# EAGLE design ProtoShield_V4.0 (EAGLE 7.2.0)
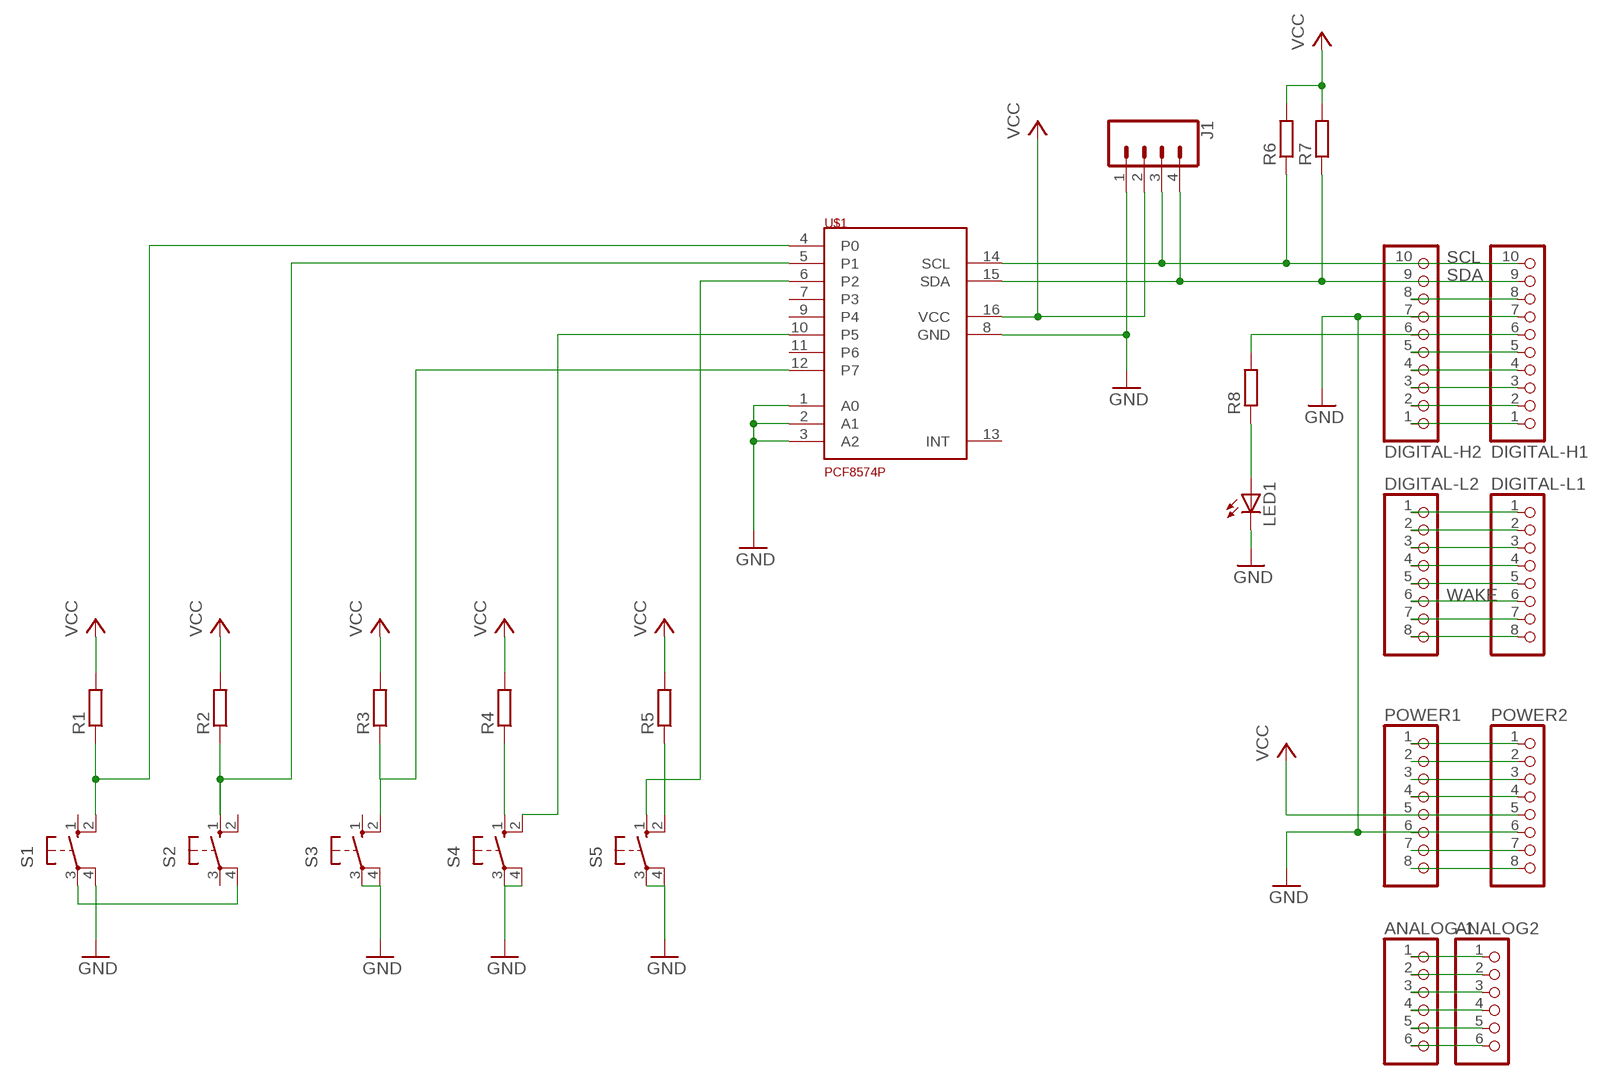
[diagram p0: schematic, sheet 1]

## Parts
ANALOG2  PINHD-1X6  [1X06]
ANALOG-1  PINHD-1X6  [1X06]
DIGITAL-H1  PINHD-1X10TH  [1X10-TH]
DIGITAL-H2  PINHD-1X10TH  [1X10-TH]
DIGITAL-L1  PINHD-1X8  [1X08]
DIGITAL-L2  PINHD-1X8  [1X08]
J1  CONN_04PTH  [1X04]
LED1  LED3MM  [LED3MM]
POWER1  PINHD-1X8TH  [1X08-TH]
POWER2  PINHD-1X8TH  [1X08-TH]
R1  R-EU_0207/10  [0207/10]
R2  R-EU_0207/10  [0207/10]
R3  R-EU_0207/10  [0207/10]
R4  R-EU_0207/10  [0207/10]
R5  R-EU_0207/10  [0207/10]
R6  R-EU_0207/10  [0207/10]
R7  R-EU_0207/10  [0207/10]
R8  R-EU_0207/10  [0207/10]
S1  10-XX  [B3F-10XX]
S2  10-XX  [B3F-10XX]
S3  10-XX  [B3F-10XX]
S4  10-XX  [B3F-10XX]
S5  10-XX  [B3F-10XX]
U$1  PCF8574P  [DIL16]

## Nets
GND: DIGITAL-H1.7 DIGITAL-H2.7 J1.1 LED1.K(C) POWER1.6 POWER2.6 S1.4(P1) S3.3(P) S3.4(P1) S4.3(P) S4.4(P1) S5.3(P) S5.4(P1) U$1.1(A0) U$1.2(A1) U$1.3(A2) U$1.8(GND)
IOREF: POWER1.2 POWER2.2
N$1: DIGITAL-H1.6 DIGITAL-H2.6 R8.2
N$2: DIGITAL-H1.1 DIGITAL-H2.1
N$3: DIGITAL-H1.4 DIGITAL-H2.4
N$4: DIGITAL-H1.5 DIGITAL-H2.5
N$5: R2.1 S2.1(S) U$1.5(P1)
N$6: DIGITAL-H1.2 DIGITAL-H2.2
N$7: DIGITAL-H1.3 DIGITAL-H2.3
N$8: DIGITAL-L1.1 DIGITAL-L2.1
N$9: DIGITAL-L1.2 DIGITAL-L2.2
N$10: DIGITAL-L1.3 DIGITAL-L2.3
N$11: DIGITAL-L1.4 DIGITAL-L2.4
N$12: DIGITAL-L1.5 DIGITAL-L2.5
N$13: POWER1.7 POWER2.7
N$14: DIGITAL-L1.7 DIGITAL-L2.7
N$15: DIGITAL-L1.8 DIGITAL-L2.8
N$16: S1.3(P) S2.4(P1)
N$17: R1.1 S1.2(S1) U$1.4(P0)
N$18: ANALOG2.1 ANALOG-1.1
N$19: ANALOG2.2 ANALOG-1.2
N$20: ANALOG2.3 ANALOG-1.3
N$21: ANALOG2.4 ANALOG-1.4
N$22: ANALOG2.5 ANALOG-1.5
N$23: ANALOG2.6 ANALOG-1.6
N$24: LED1.A R8.1
N$26: R3.1 S3.2(S1) U$1.12(P7)
N$27: POWER1.3 POWER2.3
N$28: POWER1.8 POWER2.8
N$29: R4.1 S4.1(S)
N$31: R5.1 S5.2(S1)
N$32: POWER1.1 POWER2.1
N$33: S4.2(S1) U$1.10(P5)
N$36: POWER1.4 POWER2.4
N$37: S5.1(S) U$1.6(P2)
N$222: DIGITAL-H1.8 DIGITAL-H2.8
SCL: DIGITAL-H1.10 DIGITAL-H2.10 J1.3 R6.1 U$1.14(SCL)
SDA: DIGITAL-H1.9 DIGITAL-H2.9 J1.4 R7.1 U$1.15(SDA)
VCC: J1.2 POWER1.5 POWER2.5 R1.2 R2.2 R3.2 R4.2 R5.2 R6.2 R7.2 U$1.16(VCC)
WAKE: DIGITAL-L1.6 DIGITAL-L2.6
Unconnected: S1.1(S) S2.2(S1) S2.3(P) S3.1(S) U$1.7(P3) U$1.9(P4) U$1.11(P6) U$1.13(INT)

## Library data of the parts
ANALOG2 ANALOG-1 = pinhead:PINHD-1X6: PIN HEADER; OC_FARNELL: unknown
DIGITAL-H1 DIGITAL-H2 = SmartPrj:PINHD-1X10: PIN HEADER; OC_FARNELL: unknown
DIGITAL-L1 DIGITAL-L2 = pinhead:PINHD-1X8: PIN HEADER; MF: EPCOS; MPN: B67345B0001X087; OC_FARNELL: 2355112
J1 = SparkFun-Connectors:CONN_04: Multi connection point. Often used as Generic Header-pin footprint for 0.1 inch spaced/style header connections On any of the 0.1 inch spaced packages, you can populate with these: Break Away Headers - Straight <https://www.sparkfun.com/products/116> (PRT-00116) Break Away Male Headers - Right Angle <https://www.sparkfun.com/products/553> (PRT-00553) Female Headers <https://www.sparkfun.com/products/115> (PRT-00115) Break Away Headers - Machine Pin <https://www.sparkfun.com/products/117> (PRT-00117) Break Away Female Headers - Swiss Machine Pin <https://www.sparkfun.com/products/743> (PRT-00743) For SCREWTERMINALS and SPRING TERMINALS visit here: Screw Terimnals on SparkFun.com <https://www.sparkfun.com/search/results?term=Screw+Terminals> (5mm/3.5mm/2.54mm spacing) This device is also useful as a general connection point to wire up your design to another part of your project. Our various solder wires solder well into these plated through hole pads. Hook-Up Wire - Assortment (Stranded, 22 AWG) <https://www.sparkfun.com/products/11375> (PRT-11375) Hook-Up Wire - Assortment (Solid Core, 22 AWG) <https://www.sparkfun.com/products/11367> (PRT-11367) View the entire wire category on our website here <https://www.sparkfun.com/categories/141> Special notes: Molex polarized connector foot print use with SKU : PRT-08231 with associated crimp pins and housings. 1MM SMD Version SKU: PRT-10208; PROD_ID: CONN-09696
LED1 = led:LED: LED OSRAM: - CHIPLED LG R971, LG N971, LY N971, LG Q971, LY Q971, LO R971, LY R971 LH N974, LH R974 LS Q976, LO Q976, LY Q976 LO Q996 - Hyper CHIPLED LW Q18S LB Q993, LB Q99A, LB R99A - SideLED LS A670, LO A670, LY A670, LG A670, LP A670 LB A673, LV A673, LT A673, LW A673 LH A674 LY A675 LS A676, LA A676, LO A676, LY A676, LW A676 LS A679, LY A679, LG A679 - Hyper Micro SIDELED® LS Y876, LA Y876, LO Y876, LY Y876 LT Y87S - SmartLED LW L88C, LW L88S LB L89C, LB L89S, LG L890 LS L89K, LO L89K, LY L89K LS L896, LA L896, LO L896, LY L896 - TOPLED LS T670, LO T670, LY T670, LG T670, LP T670 LSG T670, LSP T670, LSY T670, LOP T670, LYG T670 LG T671, LOG T671, LSG T671 LB T673, LV T673, LT T673, LW T673 LH T674 LS T676, LA T676, LO T676, LY T676, LB T676, LH T676, LSB T676, LW T676 LB T67C, LV T67C, LT T67C, LS T67K, LO T67K, LY T67K, LW E67C LS E67B, LA E67B, LO E67B, LY E67B, LB E67C, LV E67C, LT E67C LW T67C LS T679, LY T679, LG T679 LS T770, LO T770, LY T770, LG T770, LP T770 LB T773, LV T773, LT T773, LW T773 LH T774 LS E675, LA E675, LY E675, LS T675 LS T776, LA T776, LO T776, LY T776, LB T776 LHGB T686 LT T68C, LB T68C - Hyper Mini TOPLED® LB M676 - Mini TOPLED Santana® LG M470 LS M47K, LO M47K, LY M47K Source: http://www.osram.convergy.de LUXEON: - LUMILED® LXK2-PW12-R00, LXK2-PW12-S00, LXK2-PW14-U00, LXK2-PW14-V00 LXK2-PM12-R00, LXK2-PM12-S00, LXK2-PM14-U00 LXK2-PE12-Q00, LXK2-PE12-R00, LXK2-PE12-S00, LXK2-PE14-T00, LXK2-PE14-U00 LXK2-PB12-K00, LXK2-PB12-L00, LXK2-PB12-M00, LXK2-PB14-N00, LXK2-PB14-P00, LXK2-PB14-Q00 LXK2-PR12-L00, LXK2-PR12-M00, LXK2-PR14-Q00, LXK2-PR14-R00 LXK2-PD12-Q00, LXK2-PD12-R00, LXK2-PD12-S00 LXK2-PH12-R00, LXK2-PH12-S00 LXK2-PL12-P00, LXK2-PL12-Q00, LXK2-PL12-R00 Source: www.luxeon.com KINGBRIGHT: KA-3528ASYC Source: www.kingbright.com
POWER1 POWER2 = SmartPrj:PINHD-1X8: PIN HEADER; OC_FARNELL: unknown
R1-R8 = resistor:R-EU_: RESISTOR, European symbol
S1-S5 = switch-omron:10-XX: OMRON SWITCH; MPN: B3F-1000; OC_FARNELL: 176432; OC_NEWARK: 36M3542
U$1 = pcf8574p:PCF8574P

## Net classes
0 default: clearance 0.405 mm

## Board
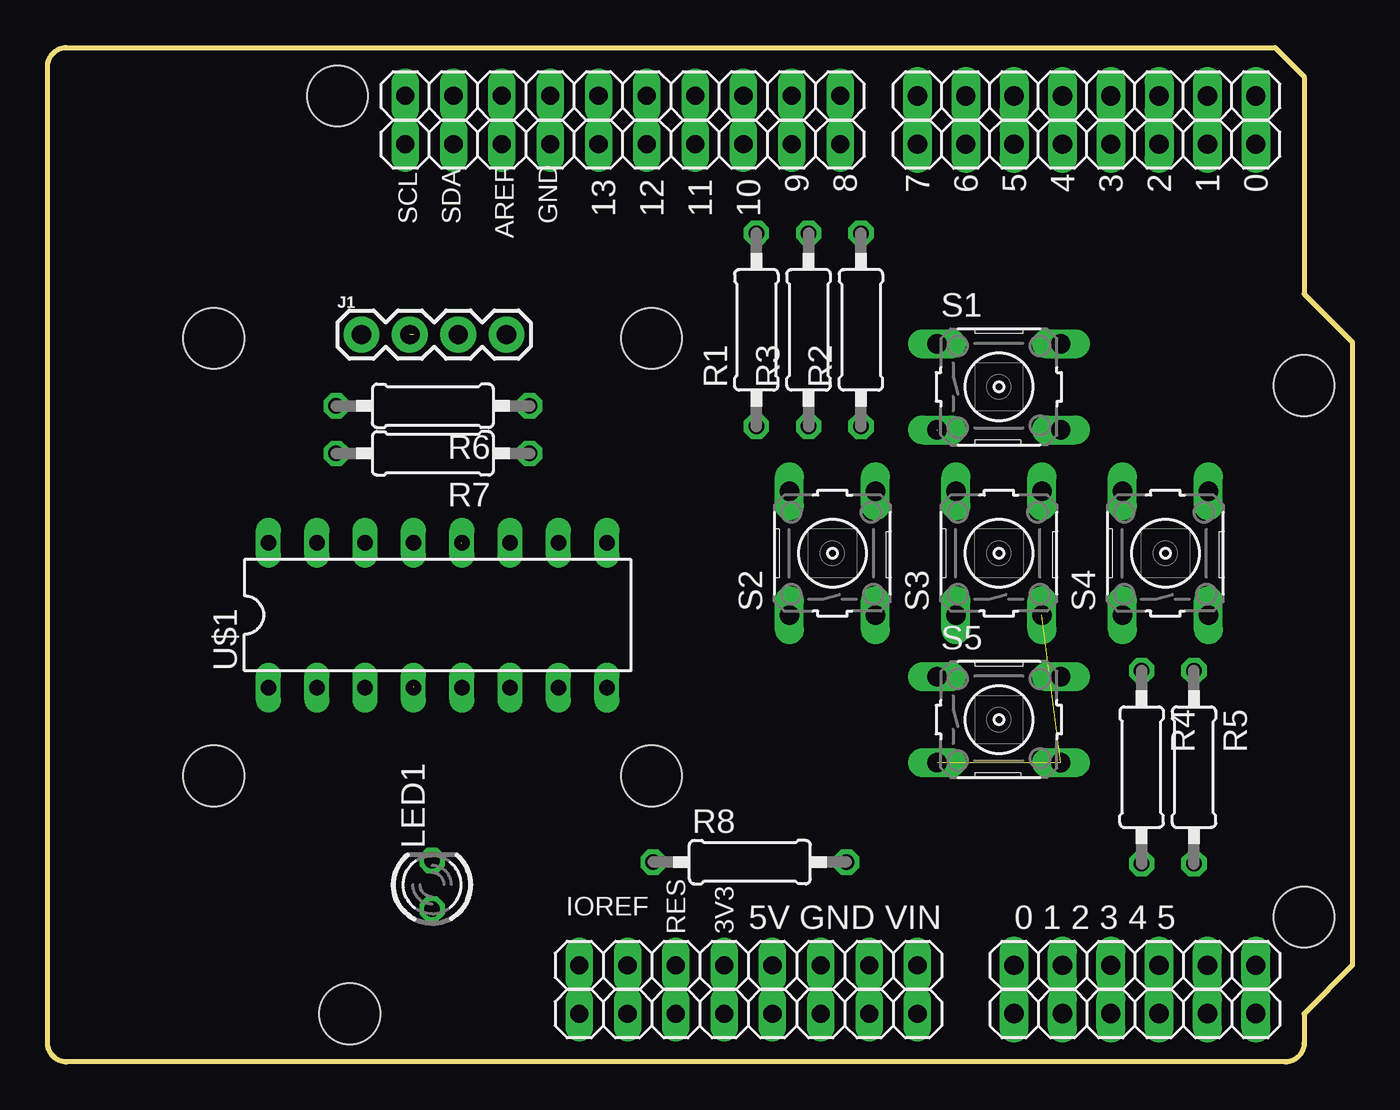
[diagram p1: board, top side]
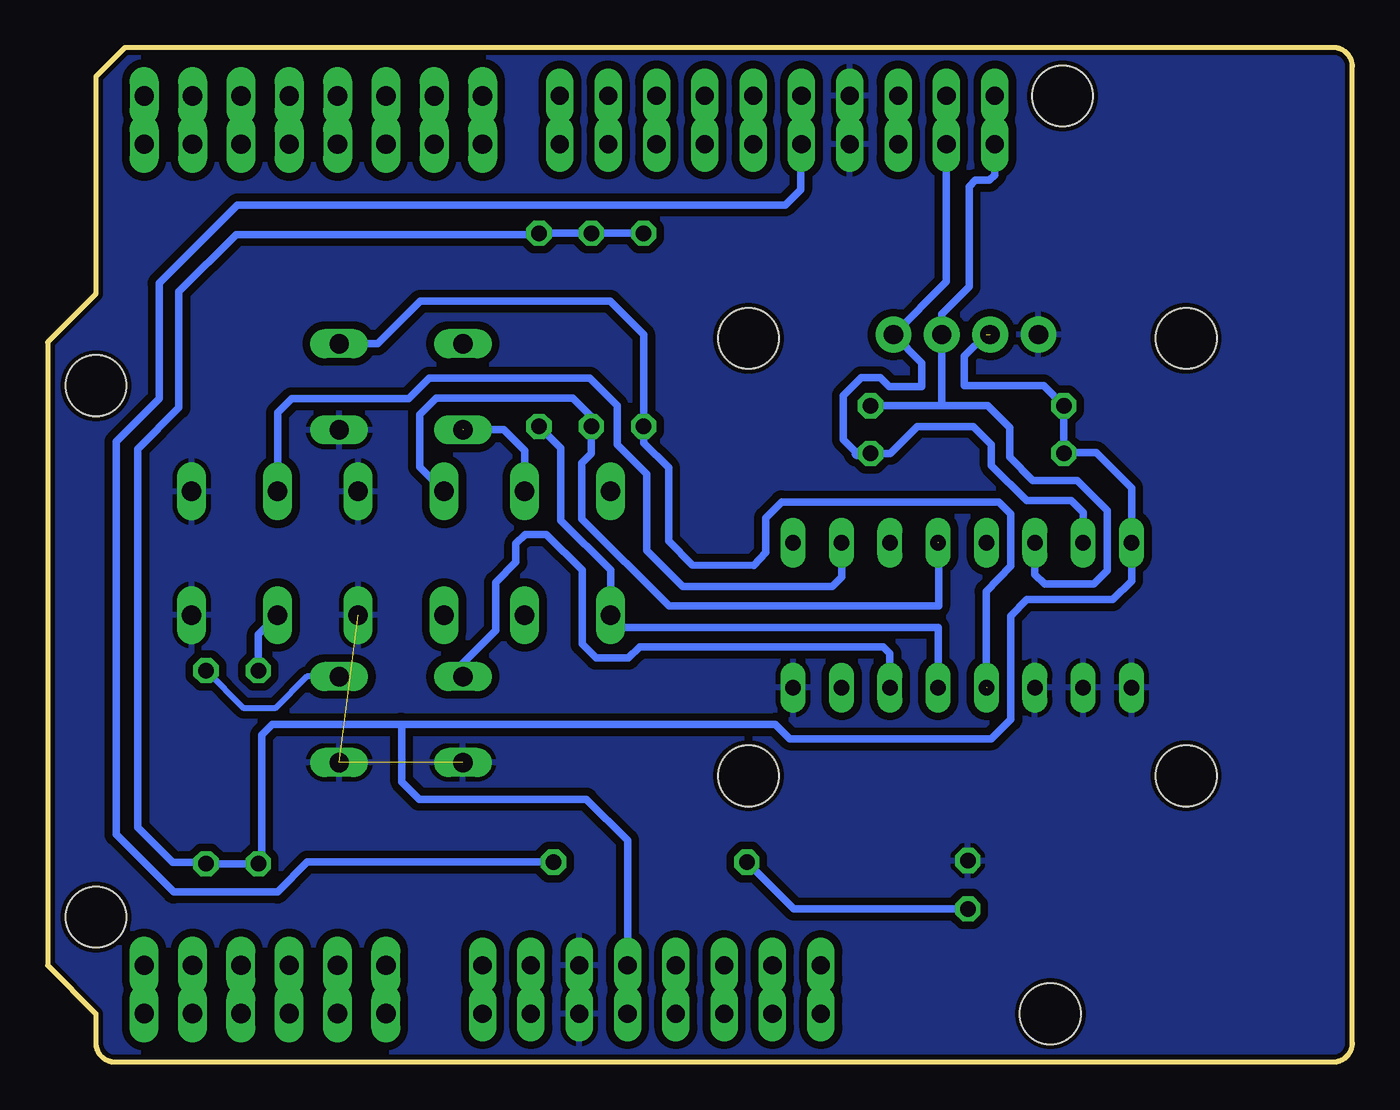
[diagram p2: board, bottom side, seen from below]

Size 68.58 x 53.34 mm. Coordinates in mm from the lower left corner, seen from the top.
Outline: 64.52,53.34 66.04,51.82 66.04,40.39 68.58,37.85 68.58,5.08 66.04,2.54 66.04,1 arc-90 65.04,0 1,0 arc-90 0,1 0,52.34 arc-90 1,53.34 64.52,53.34
Copper layers (1*16): Top 0.035mm / dielectric 1.5mm / Bottom 0.035mm
Design rules "SeeedStudio_2layers *": minimum track width 6mil, minimum drill 12mil, track to track 8mil, track to pad 8mil, pad to pad 8mil, via to via 8mil, smd to smd 0mil, copper to edge 10mil, drill to drill 10mil, minimum pad ring 10mil, minimum via ring 6mil, stop-mask expansion 2mil, vias tented up to drill 100mil, thermal gap 10mil
Holes 3.2 mm at 15.24,50.8 66.04,7.62 66.04,35.56 15.88,2.54 8.74,38.05 31.74,38.05 8.74,15.05 31.74,15.05

### Footprints (pad centres in the part's own frame; a part is rotated, then mirrored left to right if it is on the bottom)
1X06 = drill 1.016 long: 1 -6.35,0; 2 -3.81,0; 3 -1.27,0; 4 1.27,0; 5 3.81,0; 6 6.35,0
1X10-TH = drill 0.95 pad 1.422 long: 1 -11.43,0; 2 -8.89,0; 3 -6.35,0; 4 -3.81,0; 5 -1.27,0; 6 1.27,0; 7 3.81,0; 8 6.35,0; 9 8.89,0; 10 11.43,0
1X08 = drill 1.016 long: 1 -8.89,0; 2 -6.35,0; 3 -3.81,0; 4 -1.27,0; 5 1.27,0; 6 3.81,0; 7 6.35,0; 8 8.89,0
1X04 = drill 1.016 pad 1.88: 1 0,0; 2 2.54,0; 3 5.08,0; 4 7.62,0
LED3MM = drill 0.813 octagon: A -1.27,0; K 1.27,0
1X08-TH = drill 0.95 pad 1.422 long: 1 -8.89,0; 2 -6.35,0; 3 -3.81,0; 4 -1.27,0; 5 1.27,0; 6 3.81,0; 7 6.35,0; 8 8.89,0
0207/10 = drill 0.813 octagon: 1 -5.08,0; 2 5.08,0
B3F-10XX = drill 1.016 long: 1 -3.251,2.261; 2 3.251,2.261; 3 -3.251,-2.261; 4 3.251,-2.261
DIL16 = drill 0.813 long: 1 -8.89,-3.81; 2 -6.35,-3.81; 3 -3.81,-3.81; 4 -1.27,-3.81; 5 1.27,-3.81; 6 3.81,-3.81; 7 6.35,-3.81; 8 8.89,-3.81; 9 8.89,3.81; 10 6.35,3.81; 11 3.81,3.81; 12 1.27,3.81; 13 -1.27,3.81; 14 -3.81,3.81; 15 -6.35,3.81; 16 -8.89,3.81

### Placement (x,y rotation side)
ANALOG2  57.15,5.08 0 top
ANALOG-1  57.15,2.54 0 top
DIGITAL-H1  30.23,48.26 180 top
DIGITAL-H2  30.23,50.8 180 top
DIGITAL-L1  54.61,48.26 180 top
DIGITAL-L2  54.61,50.8 180 top
J1  16.5,38.25 0 top
LED1  20.21,9.32 90 top
POWER1  36.83,5.08 0 top
POWER2  36.83,2.54 0 top
R1  37.25,38.5 90 top
R2  42.75,38.5 90 top
R3  40,38.5 90 top
R4  57.5,15.5 270 top
R5  60.25,15.5 270 top
R6  20.25,34.5 180 top
R7  20.25,32 180 top
R8  36.91,10.51 0 top
S1  50,35.5 0 top
S2  41.25,26.75 90 top
S3  50,26.75 90 top
S4  58.75,26.75 90 top
S5  50,18 0 top
U$1  20.5,23.5 0 top

### Tracks (layer width: path | path; a pad name or v marks a point on that pad's centre or on a via)
GND  (2 unrouted)
  pour Bottom: -1.27,54.61 69.85,54.61 69.85,-2.54 -1.27,-2.54
IOREF
  Bottom 0.813: POWER2.2 POWER1.2
N$1
  Bottom 0.406: 29.01,48.21 29.01,45.87 29.82,45.06 58.6,45.06 62.71,40.95 62.71,34.87 64.97,32.61 64.97,11.96 61.95,8.94 56.49,8.94 54.92,10.51 R8.2
  Bottom 0.61: 29.01,48.21 DIGITAL-H1.6
  Bottom 0.813: DIGITAL-H1.6 DIGITAL-H2.6
N$2
  Bottom 0.813: DIGITAL-H1.1 DIGITAL-H2.1
N$3
  Bottom 0.813: DIGITAL-H1.4 DIGITAL-H2.4
N$4
  Bottom 0.813: DIGITAL-H1.5 DIGITAL-H2.5
N$5
  Bottom 0.406: R2.1 41.61,32.28 41.61,28.48 38.99,25.86 S2.1 38.35,22.86 21.77,22.86 U$1.5
N$6
  Bottom 0.813: DIGITAL-H1.2 DIGITAL-H2.2
N$7
  Bottom 0.813: DIGITAL-H1.3 DIGITAL-H2.3
N$8
  Bottom 0.813: DIGITAL-L1.1 DIGITAL-L2.1
N$9
  Bottom 0.813: DIGITAL-L1.2 DIGITAL-L2.2
N$10
  Bottom 0.813: DIGITAL-L1.3 DIGITAL-L2.3
N$11
  Bottom 0.813: DIGITAL-L1.4 DIGITAL-L2.4
N$12
  Bottom 0.813: DIGITAL-L1.5 DIGITAL-L2.5
N$13
  Bottom 0.61: POWER2.7 POWER1.7
N$14
  Bottom 0.813: DIGITAL-L1.7 DIGITAL-L2.7
N$15
  Bottom 0.813: DIGITAL-L1.8 DIGITAL-L2.8
N$16  (1 unrouted)
  Bottom 0.406: S2.4 43.51,32.16 44.6,33.25 S1.3
N$17  (1 unrouted)
  Bottom 0.406: S1.2 51.24,37.76 49,40 39,40 37.25,38.25 R1.1 37.25,32.55 35.94,31.24 35.94,27.4 34.7,26.14 31.47,26.11 30.84,26.79 30.84,28.61 30,29.45 18.6,29.45 17.96,28.81 17.96,26.07 19.25,24.75 19.25,19.71
N$18
  Bottom 0.813: ANALOG-1.1 ANALOG2.1
N$19
  Bottom 0.813: ANALOG-1.2 ANALOG2.2
N$20
  Bottom 0.813: ANALOG-1.3 ANALOG2.3
N$21
  Bottom 0.813: ANALOG-1.4 ANALOG2.4
N$22
  Bottom 0.813: ANALOG-1.5 ANALOG2.5
N$23
  Bottom 0.813: ANALOG-1.6 ANALOG2.6
N$24
  Bottom 0.406: R8.1 29.36,8.05 LED1.A
  Bottom 0.61: R8.1
N$26  (1 unrouted)
  Bottom 0.406: 21.75,27.29 21.75,23.97 35.91,23.97 40.5,28.56 40.5,31.5 40,32 R3.1 40,33.93 40.97,34.9 48.16,34.9 49.02,34.04 49.02,31.28 S3.2
N$27
  Bottom 0.813: POWER1.3 POWER2.3
N$28
  Bottom 0.813: POWER2.8 POWER1.8
N$29
  Bottom 0.406: R4.1 57.5,22.49 S4.1
N$31
  Bottom 0.305: S5.2 54.95,20.26 56.62,18.59 58.26,18.59 R5.1
N$32
  Bottom 0.813: POWER2.1 POWER1.1
N$33
  Bottom 0.406: S4.2 56.49,34.14 55.75,34.87 49.61,34.87 48.52,35.95 40.08,35.95 38.65,34.52 38.65,32.48 37.1,30.93 37.1,26.89 35.2,24.99 27.35,24.99 26.85,25.49 U$1.10
N$36
  Bottom 0.61: POWER2.4 POWER1.4
N$37
  Bottom 0.406: S5.1 46.75,20.97 45.03,22.68 45.03,25.22 43.97,26.29 43.97,27.25 43.48,27.74 42.37,27.74 40.49,25.86 40.49,21.97 39.75,21.23 38.05,21.23 37.47,21.82 24.66,21.82 24.31,21.47 U$1.6
N$222
  Bottom 0.813: DIGITAL-H1.8 DIGITAL-H2.8
SCL
  Bottom 0.406: DIGITAL-H1.10 18.8,46.63 19.07,46.35 19.81,46.35 20.14,46.02 20.14,40.77 21.58,39.33 J1.3 21.59,34.56 21.63,34.52 | U$1.14 16.69,25.63 16.18,25.12 13.59,25.12 12.88,25.83 12.88,29.01 14.45,30.58 16.79,30.58 18.01,31.8 18.01,33.35 19.18,34.52 21.63,34.52 | 21.63,34.52 25.31,34.52 R6.1
  Bottom 0.813: DIGITAL-H1.10 DIGITAL-H2.10
SDA
  Bottom 0.406: DIGITAL-H1.9 21.34,41.03 J1.4 22.63,36.76 22.63,35.5 24.35,35.5 24.82,35.98 25.82,35.98 26.75,35.05 26.75,32.72 26.03,32 | R7.1 24.28,32 22.86,33.42 19.92,33.42 18.97,32.47 18.97,31.37 17.12,29.52 14.78,29.52 14.15,28.88 U$1.15
  Bottom 0.61: J1.4 | R7.1 26.03,32
  Bottom 0.813: DIGITAL-H1.9 DIGITAL-H2.9
VCC  (2 unrouted)
  Bottom 0.406: R1.2 R3.2 R2.2 | R4.2 R5.2 | 42.83,43.5 58.67,43.5 61.67,40.5 61.67,34.4 63.85,32.23 63.85,12.35 62,10.5 60.33,10.5 | 19.25,38.25 20.4,37.1 20.4,35.56 16.23,35.56 R6.2 R7.2 15.14,32.03 13.46,32.03 11.61,30.18 U$1.16 | 57.33,10.25 57.33,17.19 56.77,17.75 50.01,17.75 | 50.01,17.75 30.33,17.75 29.57,16.99 18.97,16.99 17.96,18.01 17.96,23.44 17.12,24.31 12.6,24.31 11.61,25.3 U$1.16 | POWER1.5 38.1,11.66 40.26,13.82 49.05,13.82 49.96,14.73 49.96,17.7 50.01,17.75
  Bottom 0.61: 57.33,10.25 R4.2 | 60.33,10.5 R5.2 | 42.83,43.5 R2.2 | POWER2.5 POWER1.5
WAKE
  Bottom 0.813: DIGITAL-L1.6 DIGITAL-L2.6

### Text on the board
tPlace: 9 | 8 | 7 | 6 | 5 | 4 | 3 | 2 | 1 | 0 | 13 | 12 | 11 | 10
tNames: SCL | SDA | GND | AREF | IOREF | RES | 3V3 | 5V GND VIN | 0 1 2 3 4 5